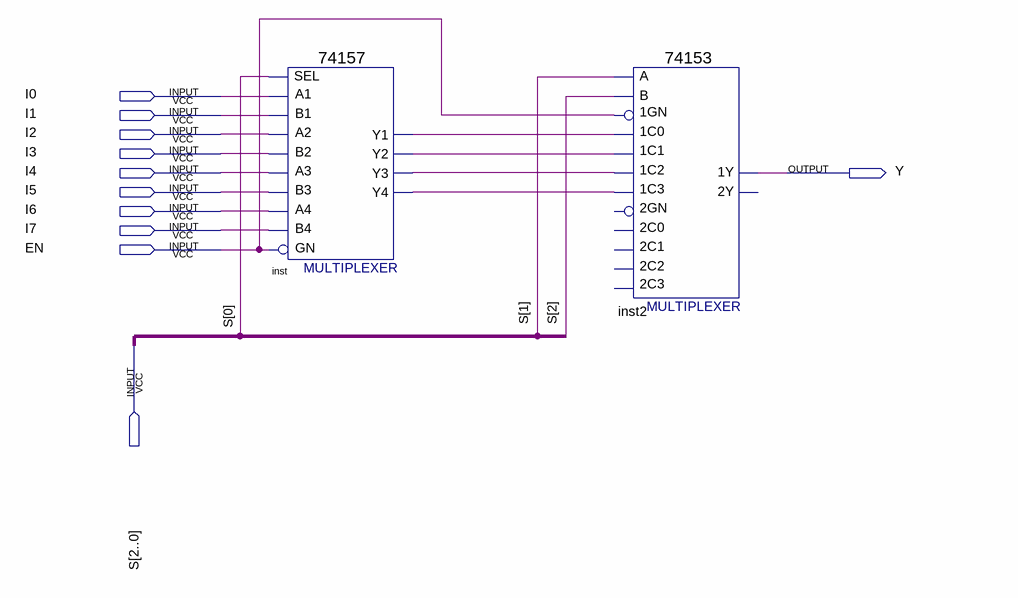
[diagram p0: schematic sheet]
// Quartus schematic p2.bdf as structural Verilog: 2 symbols, 11 pins
module p2 (
  input  I0,
  input  I1,
  input  I2,
  input  I3,
  input  I4,
  input  I5,
  input  I6,
  input  I7,
  input  EN,
  input  [2:0] S,
  output Y
);

  wire inst_y1, inst_y2, inst_y3, inst_y4;

  \74157  inst (
    .A1(I0), .B1(I1), .SEL(S[0]), .B2(I3), .A3(I4), .B3(I5), .A2(I2), .B4(I7), .GN(EN), .A4(I6),
    .Y2(inst_y2), .Y1(inst_y1), .Y4(inst_y4), .Y3(inst_y3));
  \74153  inst2 (
    .\1C1 (inst_y2), .\1GN (EN), .\1C0 (inst_y1), .\1C2 (inst_y3), .\1C3 (inst_y4), .B(S[2]), .A(S[1]),
    .\1Y (Y));  // open: 2C0, 2GN, 2C2, 2C1, 2C3, 2Y
endmodule
